# Altium project DPCB.PrjPcb
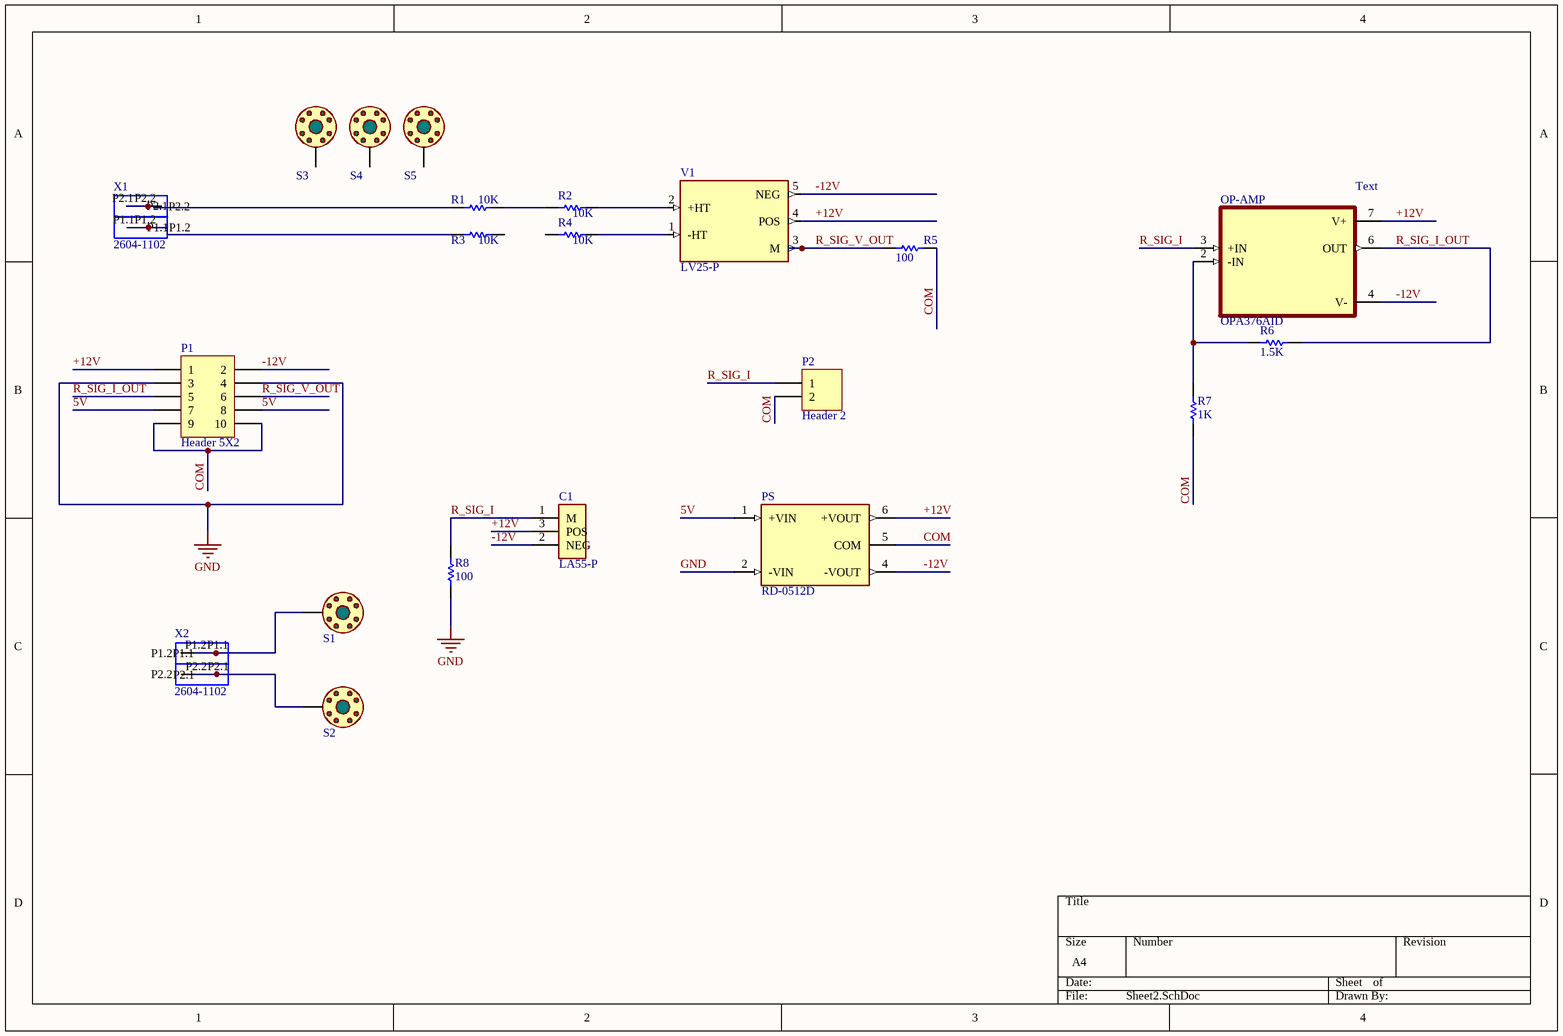
[diagram p0: Sheet2.SchDoc]
1 sheet, 21 parts. Net scope: global (net labels, ports and power ports of the same name join across sheets).
Board file: PCB1.PcbDoc

## Sheet Sheet2.SchDoc
size A4

### Parts
C1  LA55-P  [XDCR_LA55-P]
OP-AMP  OPA376AID  [SOIC127P599X175-8N]
P1  Header 5X2  [HDR2X5]
P2  Header 2  [HDR1X2]
PS  RD-0512D  [CONV_RD-0512D]
R1  10K  [MY_(3w)_0817V]
R2  10K  [MY_(3w)_0817V]
R3  10K  [MY_(3w)_0817V]
R4  10K  [MY_(3w)_0817V]
R5  100  [MY_0805]
R6  1.5K  [MY_1206]
R7  1K  [MY_1206]
R8  100  [MY_0805]
S1  Screw  [MY_PAD_3MM]  (value not drawn)  (net tie, no BOM)
S2  Screw  [MY_PAD_3MM]  (value not drawn)  (net tie, no BOM)
S3  Screw  [MY_PAD_3MM]  (value not drawn)  (net tie, no BOM)
S4  Screw  [MY_PAD_3MM]  (value not drawn)  (net tie, no BOM)
S5  Screw  [MY_PAD_3MM]  (value not drawn)  (net tie, no BOM)
V1  LV25-P  [XDCR_LV25-P]
X1  2604-1102  [P-2604-1102]
X2  2604-1102  [P-2604-1102]

### Nets
GND: P1.3 P1.4 PS.2(-VIN) R8.2
5V: P1.7 P1.8 PS.1(+VIN)
+12V: C1.3(POS) OP-AMP.7(V+) P1.1 PS.6(+VOUT) V1.4(POS)
-12V: C1.2(NEG) OP-AMP.4(V-) P1.2 PS.4(-VOUT) V1.5(NEG)
COM: P1.9 P1.10 P2.2 PS.5(COM) R5.2 R7.2
R_SIG_I: C1.1(M) OP-AMP.3(+IN) P2.1 R8.1
R_SIG_I_OUT: OP-AMP.6(OUT) P1.5 R6.2
R_SIG_V_OUT: P1.6 R5.1 V1.3(M)
NetOP-AMP_2: OP-AMP.2(-IN) R6.1 R7.1
NetR1_1: R1.1 R2.1
NetR1_2: R1.2 X1.P2.1 X1.P2.2
NetR2_2: R2.2 V1.2(+HT)
NetR3_1: R3.1 X1.P1.1 X1.P1.2
NetR4_2: R4.2 V1.1(-HT)
NetS1_0: S1.0 X2.P1.1 X2.P1.2
NetS2_0: S2.0 X2.P2.1 X2.P2.2

Not connected (* = marked no-connect by the designer): R3 2; R4 1; S3 0; S4 0; S5 0

### Notes on the sheet
- (near OP-AMP) Text

### Library data of the parts
C1 = LA55-P: Current Sensor 50A 1 Channel Hall Effect, Closed Loop Bidirectional Module, Single Pass Through; MF: LEM USA; Package: Module LEM USA; Price: None; Check_prices: https://www.snapeda.com/parts/LA%2055-P/LEM+USA+Inc./view-part/?ref=eda; Value: *; SnapEDA_Link: https://www.snapeda.com/parts/LA%2055-P/LEM+USA+Inc./view-part/?ref=snap; MP: LA 55-P; Availability: In Stock; Purchase-URL: https://pricing.snapeda.com/search?q=LA 55-P&ref=eda
OP-AMP = OPA376AID: Precision (0.025mV), low noise (7.5nV/rtHz), low quiescent current (760uA) op amp 8-SOIC -40 to 125; MF: Texas Instruments; Texas_Instruments-Purchase-URL: https://snapeda.com/shop?store=Texas+Instruments&id=572715; Arrow_Electronics-Purchase-URL: https://snapeda.com/shop?store=Arrow+Electronics&id=572715; Value: *; SnapEDA_Link: https://www.snapeda.com/parts/OPA376AID/Texas%20Instruments/view-part/572715/?ref=snap; DigiKey-Purchase-URL: https://snapeda.com/shop?store=DigiKey&id=572715; Package: SOIC-8 Texas Instruments; MP: OPA376AID; Mouser-Purchase-URL: https://snapeda.com/shop?store=Mouser&id=572715; Price: None; Availability: Good; BuyPart: https://www.snapeda.com/parts/OPA376AID/Texas%20Instruments/view-part/572715/?ref=eda
P1 = Header 5X2: Header, 5-Pin, Dual row; LatestRevisionDate: 17-Jul-2002; LatestRevisionNote: Re-released for DXP Platform.; Publisher: Altium Limited
P2 = Header 2: Header, 2-Pin; LatestRevisionDate: 17-Jul-2002; LatestRevisionNote: Re-released for DXP Platform.; Publisher: Altium Limited
PS = RD-0512D: 2W DC/DC-Converter 'ECONOLINE' SIP7 1kV unreg; MF: Recom Power; Digi-Key_Purchase_URL: https://www.digikey.com/product-detail/en/recom-power/RD-0512D-P/945-1821-5-ND/2303656?utm_source=snapeda&utm_medium=aggregator&utm_campaign=symbol; Digi-Key_Part_Number: 945-1821-5-ND; Package: SIP-7 Recom Power; Value: *; MP: RD-0512D; SnapEDA_Link: https://www.snapeda.com/parts/RD-0512D/Recom%20Power/view-part/3631333/?ref=snap
R1-R8 = Res: Standard resistor; ASiD Part Number: Res-AS
  R1-R4: Value: 10K
  R5 R8: Value: 100
  R6: Value: 1.5K
  R7: Value: 1K
S1-S5 = Screw: 3mm Screw; ASiD Part Number: Screw-AS
V1 = LV25-P: Voltage, Closed Loop Sensor Voltage Output; MF: LEM USA Inc.; SnapEDA_Link: https://www.snapeda.com/parts/LV%2025-P/LEM%20USA%20Inc./view-part/5138977/?ref=snap; Digi-Key_Part_Number: 398-1019-ND; Value: *; Check_prices: https://www.snapeda.com/parts/LV%2025-P/LEM%20USA%20Inc./view-part/5138977/?ref=eda; MP: LV 25-P; Package: None
X1 X2 = 2604-1102: 2 Position Wire to Board Terminal Block Horizontal with Board 0.197 (5.00mm) Through Hole; MF: WAGO Innovative Connections; Price: None; Package: None; Check_prices: https://www.snapeda.com/parts/2604-1102/WAGO/view-part/?ref=eda; Value: *; MP: 2604-1102; SnapEDA_Link: https://www.snapeda.com/parts/2604-1102/WAGO/view-part/?ref=snap; Availability: In Stock; Purchase-URL: https://pricing.snapeda.com/search/part/2604-1102/?ref=eda